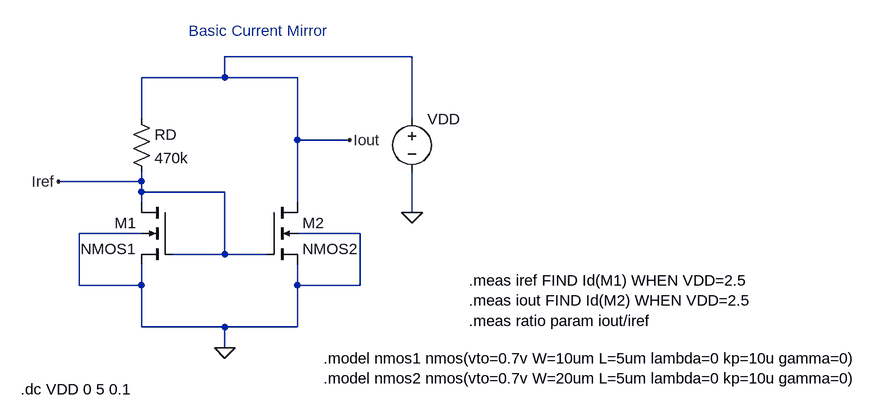
[diagram p0: schematic Current Mirror.asc]
Current Mirror.asc, the LTspice schematic file:
Version 4
SHEET 1 1244 680
WIRE 464 -80 176 -80
WIRE 176 -48 176 -80
WIRE 176 -48 48 -48
WIRE 288 -48 176 -48
WIRE 48 16 48 -48
WIRE 464 16 464 -80
WIRE 288 48 288 -48
WIRE 368 48 288 48
WIRE 48 112 48 96
WIRE 48 112 -80 112
WIRE 48 128 48 112
WIRE 176 128 48 128
WIRE 48 144 48 128
WIRE 288 144 288 48
WIRE 464 160 464 96
WIRE 48 192 -48 192
WIRE 384 192 288 192
WIRE 176 224 176 128
WIRE 176 224 96 224
WIRE 240 224 176 224
WIRE -48 272 -48 192
WIRE 48 272 48 240
WIRE 48 272 -48 272
WIRE 288 272 288 240
WIRE 384 272 384 192
WIRE 384 272 288 272
WIRE 48 336 48 272
WIRE 176 336 48 336
WIRE 288 336 288 272
WIRE 288 336 176 336
WIRE 176 368 176 336
FLAG 464 160 0
FLAG 176 368 0
FLAG 368 48 Iout
FLAG -80 112 Iref
SYMBOL nmos4 240 144 R0
SYMATTR InstName M2
SYMATTR Value NMOS2
SYMBOL nmos4 96 144 M0
SYMATTR InstName M1
SYMATTR Value NMOS1
SYMBOL res 32 0 R0
SYMATTR InstName RD
SYMATTR Value 470k
SYMBOL voltage 464 0 R0
WINDOW 123 0 0 Left 0
WINDOW 39 0 0 Left 0
SYMATTR InstName VDD
SYMATTR Value ""
TEXT 328 384 Left 2 !.model nmos1 nmos(vto=0.7v W=10um L=5um lambda=0 kp=10u gamma=0)\n.model nmos2 nmos(vto=0.7v W=20um L=5um lambda=0 kp=10u gamma=0)
TEXT -138 432 Left 2 !.dc VDD 0 5 0.1
TEXT 552 264 Left 2 !.meas iref FIND Id(M1) WHEN VDD=2.5\n.meas iout FIND Id(M2) WHEN VDD=2.5\n.meas ratio param iout/iref
TEXT 120 -120 Left 2 ;Basic Current Mirror

The netlist it stands for:
* Current Mirror.asc
M2 Iout Iref 0 0 NMOS2
M1 Iref Iref 0 0 NMOS1
RD Iout Iref 470k
VDD Iout 0
.model NMOS NMOS
.model PMOS PMOS
.lib standard.mos
.model nmos1 nmos(vto=0.7v W=10um L=5um lambda=0 kp=10u gamma=0)
.model nmos2 nmos(vto=0.7v W=20um L=5um lambda=0 kp=10u gamma=0)
.dc VDD 0 5 0.1
.meas iref FIND Id(M1) WHEN VDD=2.5
.meas iout FIND Id(M2) WHEN VDD=2.5
.meas ratio param iout/iref
* Basic Current Mirror
.backanno
.end

* Results of the author's LTspice run, read from the files saved beside the schematic
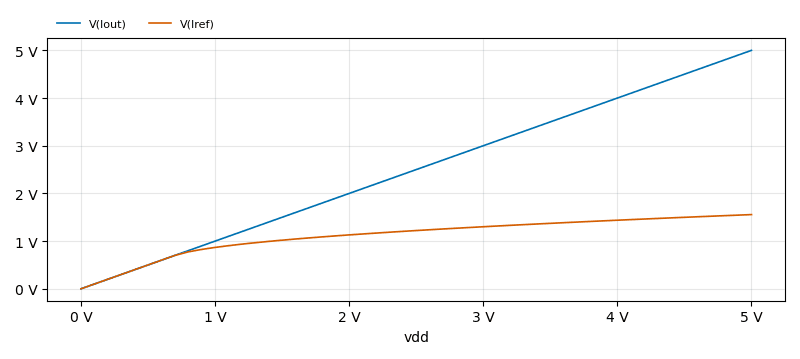
[diagram p1: DC transfer characteristic of Current Mirror.asc, plotted from the saved traces]
* DC transfer characteristic, 1 run:
*   V(Iout): 0 V at vdd=0 V, 5 V at vdd=5 V, min 0 V, max 5 V
*   V(Iref): 0 V at vdd=0 V, 1.556 V at vdd=5 V, min 0 V, max 1.556 V
* From the log:
*   iref: id(m1)=2.72012e-06 at 2.5
*   iout: id(m2)=5.44023e-06 at 2.5
*   ratio: iout/iref=2